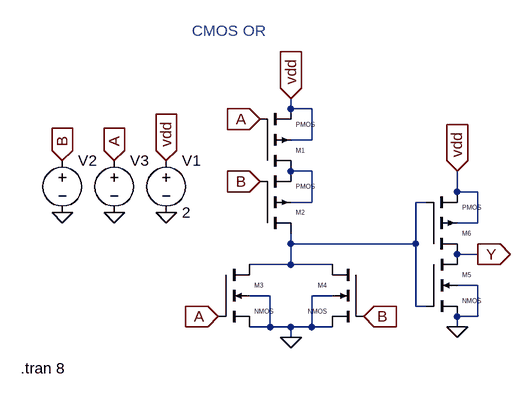
[diagram p0: schematic CMOS OR.asc]
CMOS OR.asc, the LTspice schematic file:
Version 4
SHEET 1 880 680
WIRE 320 0 320 -16
WIRE 352 0 320 0
WIRE 352 48 352 0
WIRE 352 48 320 48
WIRE 352 96 320 96
WIRE 576 128 576 96
WIRE 608 128 576 128
WIRE 352 144 352 96
WIRE 352 144 320 144
WIRE 528 144 512 144
WIRE 608 176 608 128
WIRE 608 176 576 176
WIRE 320 208 320 192
WIRE 512 208 512 144
WIRE 512 208 320 208
WIRE 608 224 576 224
WIRE 320 240 320 208
WIRE 320 240 256 240
WIRE 384 240 320 240
WIRE 608 272 576 272
WIRE 288 288 256 288
WIRE 384 288 352 288
WIRE 512 304 512 208
WIRE 528 304 512 304
WIRE 608 320 608 272
WIRE 608 320 576 320
WIRE 288 336 288 288
WIRE 288 336 256 336
WIRE 320 336 288 336
WIRE 352 336 352 288
WIRE 352 336 320 336
WIRE 384 336 352 336
WIRE 576 336 576 320
WIRE 320 352 320 336
FLAG 320 -16 vdd
IOPIN 320 -16 In
FLAG 128 80 vdd
IOPIN 128 80 In
FLAG 272 16 A
IOPIN 272 16 In
FLAG 48 80 A
IOPIN 48 80 In
FLAG 208 320 A
IOPIN 208 320 In
FLAG -32 80 B
IOPIN -32 80 In
FLAG 272 112 B
IOPIN 272 112 In
FLAG 432 320 B
IOPIN 432 320 In
FLAG 128 160 0
FLAG 48 160 0
FLAG -32 160 0
FLAG 320 352 0
FLAG 608 224 Y
IOPIN 608 224 Out
FLAG 576 336 0
FLAG 576 96 vdd
IOPIN 576 96 In
SYMBOL pmos4 272 96 M180
WINDOW 0 56 32 Left 0
WINDOW 3 56 72 Left 0
SYMATTR InstName M1
SYMBOL pmos4 272 192 M180
WINDOW 0 56 32 Left 0
WINDOW 3 56 72 Left 0
SYMATTR InstName M2
SYMBOL nmos4 208 240 R0
WINDOW 0 56 32 Left 0
WINDOW 3 56 72 Left 0
SYMATTR InstName M3
SYMBOL nmos4 432 240 M0
WINDOW 0 56 32 Left 0
WINDOW 3 56 72 Left 0
SYMATTR InstName M4
SYMBOL voltage 128 64 R0
WINDOW 123 0 0 Left 0
WINDOW 39 0 0 Left 0
SYMATTR InstName V1
SYMATTR Value 2
SYMBOL voltage -32 64 R0
WINDOW 3 24 96 Invisible 2
WINDOW 123 0 0 Left 0
WINDOW 39 0 0 Left 0
SYMATTR Value PULSE(0 2 2 0.001 0.001 2 4)
SYMATTR InstName V2
SYMBOL voltage 48 64 R0
WINDOW 3 24 96 Invisible 2
WINDOW 123 0 0 Left 0
WINDOW 39 0 0 Left 0
SYMATTR Value PULSE(0 2 4 0.001 0.001 4 8)
SYMATTR InstName V3
SYMBOL nmos4 528 224 R0
WINDOW 0 56 32 Left 0
WINDOW 3 56 72 Left 0
SYMATTR InstName M5
SYMBOL pmos4 528 224 M180
WINDOW 0 56 32 Left 0
WINDOW 3 56 72 Left 0
SYMATTR InstName M6
TEXT -96 400 Left 2 !.tran 8
TEXT 168 -120 Left 2 ;CMOS OR

The netlist it stands for:
* CMOS OR.asc
M1 N001 A vdd vdd PMOS
M2 N002 B N001 N001 PMOS
M3 N002 A 0 0 NMOS
M4 N002 B 0 0 NMOS
V1 vdd 0 2
V2 B 0 PULSE(0 2 2 0.001 0.001 2 4)
V3 A 0 PULSE(0 2 4 0.001 0.001 4 8)
M5 Y N002 0 0 NMOS
M6 Y N002 vdd vdd PMOS
.model NMOS NMOS
.model PMOS PMOS
.lib standard.mos
.tran 8
* CMOS OR
.backanno
.end